# Altium schematic sheet Half_Bridges.SchDoc
size B; SheetNumber: 3; SheetTotal: 4
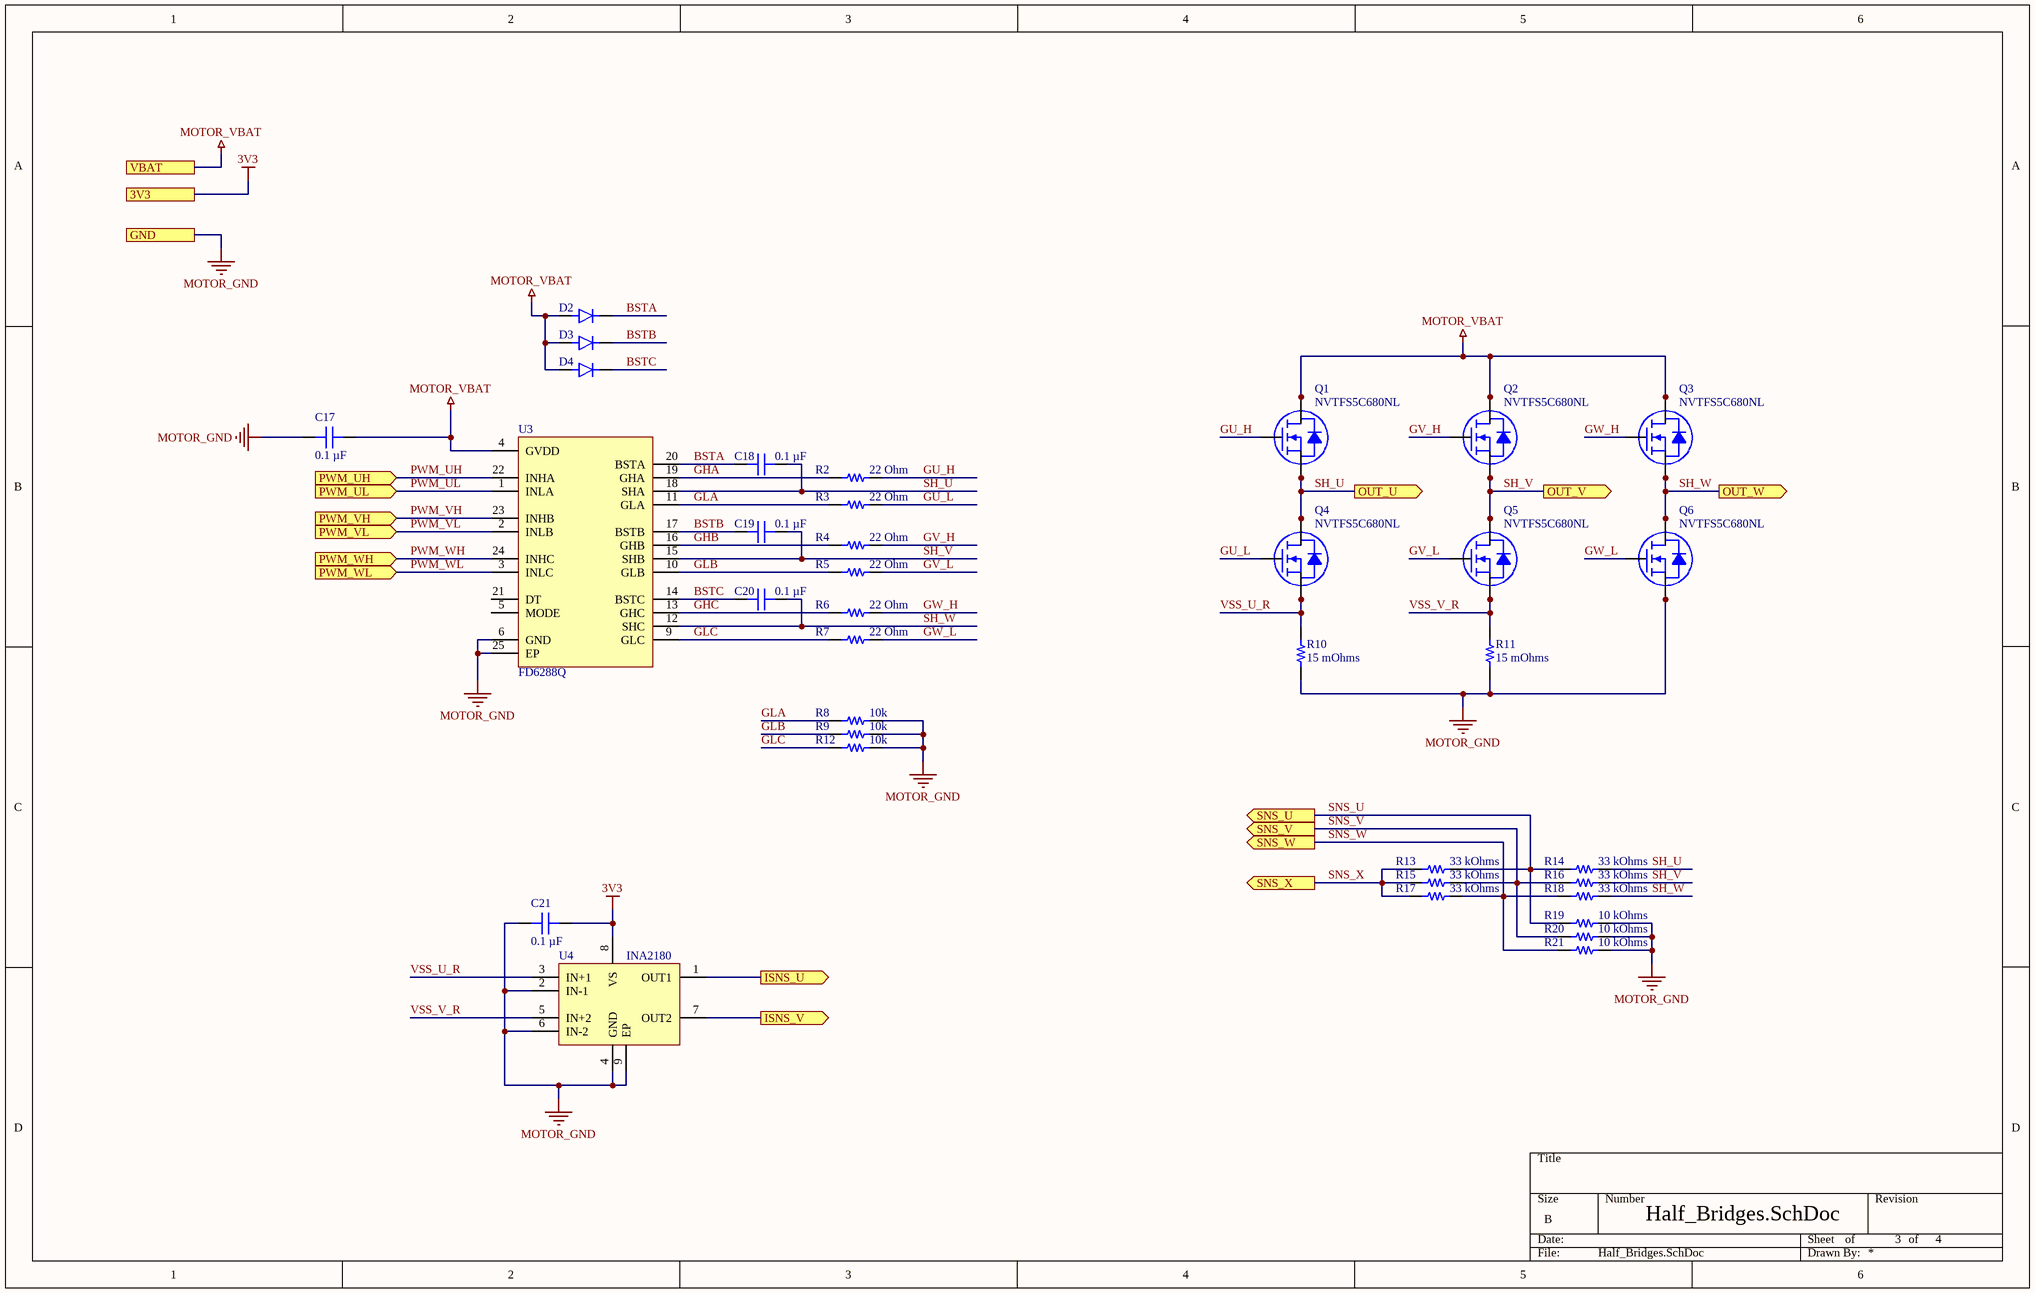
[diagram p0: Half_Bridges.SchDoc]

## Parts
C17  0.1 µF  [CAP 0402_1005]
C18  0.1 µF  [CAP 0402_1005]
C19  0.1 µF  [CAP 0402_1005]
C20  0.1 µF  [CAP 0402_1005]
C21  0.1 µF  [CAP 0402_1005]
D2  Diode  [Diode DFN1608D-2 (SOD1608)]  (value not drawn)
D3  Diode  [Diode DFN1608D-2 (SOD1608)]  (value not drawn)
D4  Diode  [Diode DFN1608D-2 (SOD1608)]  (value not drawn)
Q1  NVTFS5C680NL  [NVTFS015N04CTAG]
Q2  NVTFS5C680NL  [NVTFS015N04CTAG]
Q3  NVTFS5C680NL  [NVTFS015N04CTAG]
Q4  NVTFS5C680NL  [NVTFS015N04CTAG]
Q5  NVTFS5C680NL  [NVTFS015N04CTAG]
Q6  NVTFS5C680NL  [NVTFS015N04CTAG]
R2  22 Ohm  [RES 0402_1005]
R3  22 Ohm  [RES 0402_1005]
R4  22 Ohm  [RES 0402_1005]
R5  22 Ohm  [RES 0402_1005]
R6  22 Ohm  [RES 0402_1005]
R7  22 Ohm  [RES 0402_1005]
R8  10k  [RES 0402_1005]
R9  10k  [RES 0402_1005]
R10  15 mOhms  [RES 0805_2012]
R11  15 mOhms  [RES 0805_2012]
R12  10k  [RES 0402_1005]
R13  33 kOhms  [RES 0402_1005]
R14  33 kOhms  [RES 0402_1005]
R15  33 kOhms  [RES 0402_1005]
R16  33 kOhms  [RES 0402_1005]
R17  33 kOhms  [RES 0402_1005]
R18  33 kOhms  [RES 0402_1005]
R19  10 kOhms  [RES 0402_1005]
R20  10 kOhms  [RES 0402_1005]
R21  10 kOhms  [RES 0402_1005]
U3  FD6288Q  [QFN50P400X400X100-25N]
U4  INA2180  [WSON-8_2x2]

## Ports
3V3, GND, ISNS_U (out), ISNS_V (out), OUT_U (out), OUT_V (out), OUT_W (out), PWM_UH (in), PWM_UL (in), PWM_VH (in), PWM_VL (in), PWM_WH (in), PWM_WL (in), SNS_U (out), SNS_V (out), SNS_W (out), SNS_X (out), VBAT

## Nets
3V3: C21.1 U4.8(VS) ; port 3V3
MOTOR_GND: C17.1 C21.2 Q6.1(S) Q6.2(S) Q6.3(S) R8.2 R9.2 R10.1 R11.1 R12.2 R19.1 R20.1 R21.1 U3.6(GND) U3.25(EP) U4.2(IN-1) U4.4(GND) U4.6(IN-2) U4.9(EP) ; port GND
MOTOR_VBAT: C17.2 D2.2(BLUE(C)) D3.2(BLUE(C)) D4.2(BLUE(C)) Q1.5(D) Q1.6(D) Q1.7(D) Q1.8(D) Q2.5(D) Q2.6(D) Q2.7(D) Q2.8(D) Q3.5(D) Q3.6(D) Q3.7(D) Q3.8(D) U3.4(GVDD) ; port VBAT
BSTA: C18.1 D2.1(A) U3.20(BSTA)
BSTB: C19.1 D3.1(A) U3.17(BSTB)
BSTC: C20.1 D4.1(A) U3.14(BSTC)
GHA: R2.1 U3.19(GHA)
GHB: R4.1 U3.16(GHB)
GHC: R6.1 U3.13(GHC)
GLA: R3.1 R8.1 U3.11(GLA)
GLB: R5.1 R9.1 U3.10(GLB)
GLC: R7.1 R12.1 U3.9(GLC)
GU_H: Q1.4(G) R2.2
GU_L: Q4.4(G) R3.2
GV_H: Q2.4(G) R4.2
GV_L: Q5.4(G) R5.2
GW_H: Q3.4(G) R6.2
GW_L: Q6.4(G) R7.2
ISNS_U: U4.1(OUT1) ; port ISNS_U
ISNS_V: U4.7(OUT2) ; port ISNS_V
PWM_UH: U3.22(INHA) ; port PWM_UH
PWM_UL: U3.1(INLA) ; port PWM_UL
PWM_VH: U3.23(INHB) ; port PWM_VH
PWM_VL: U3.2(INLB) ; port PWM_VL
PWM_WH: U3.24(INHC) ; port PWM_WH
PWM_WL: U3.3(INLC) ; port PWM_WL
SH_U: C18.2 Q1.1(S) Q1.2(S) Q1.3(S) Q4.5(D) Q4.6(D) Q4.7(D) Q4.8(D) R14.2 U3.18(SHA) ; port OUT_U
SH_V: C19.2 Q2.1(S) Q2.2(S) Q2.3(S) Q5.5(D) Q5.6(D) Q5.7(D) Q5.8(D) R16.2 U3.15(SHB) ; port OUT_V
SH_W: C20.2 Q3.1(S) Q3.2(S) Q3.3(S) Q6.5(D) Q6.6(D) Q6.7(D) Q6.8(D) R18.2 U3.12(SHC) ; port OUT_W
SNS_U: R13.2 R14.1 R19.2 ; port SNS_U
SNS_V: R15.2 R16.1 R20.2 ; port SNS_V
SNS_W: R17.2 R18.1 R21.2 ; port SNS_W
SNS_X: R13.1 R15.1 R17.1 ; port SNS_X
VSS_U_R: Q4.1(S) Q4.2(S) Q4.3(S) R10.2 U4.3(IN+1)
VSS_V_R: Q5.1(S) Q5.2(S) Q5.3(S) R11.2 U4.5(IN+2)

Not connected (* = marked no-connect by the designer): U3 5(MODE) 21(DT)

## Notes on the sheet
- of

## Library data of the parts
C17-C21 = C0402C104K4RACAUTO: CAP CER 0.1UF 16V X7R 0402; manufacturer: KEMET; Tolerance: ±10%; Part Number: C0402C104K4RACAUTO; Value: 0.1 µF; Applications: Automotive, Bypass, Decoupling; Capacitance: 0.1 µF; componentlink1description: Datasheet; componentlink1url: https://api.kemet.com/component-edge/download/specsheet/C0402C104K4RACAUTO.pdf; componentlink2description: DigiKey Link; componentlink2url: https://www.digikey.com/en/products/detail/kemet/C0402C104K4RACAUTO/3314827; Device Package: 0402 (1005 Metric); lastupdated: 8/14/2022 9:05:51 PM; Lifecycle Status: Active; Minimum Order: 1; Mounting Type: Surface Mount, MLCC; Operating Temperature: -55°C ~ 125°C; Package / Case: 0402 (1005 Metric); packaging: TapeAndReel; partid: 3024; Part Status: Active; price: 0.01; Ratings: AEC-Q200; series: SMD Auto X7R; Size / Dimension: 0.039" L x 0.020" W (1.00mm x 0.50mm); Supplier 1: DigiKey; Supplier Part Number 1: 399-6828-1-ND; Temperature Coefficient: X7R; Thickness (Max): 0.022" (0.55mm); Voltage - Rated: 16V
D2-D4 = Diode: DFN1608D-2 (SOD1608); Manufacturer: Cree; ComponentLink2Description: Datasheet; Temperature: -40°C to +100°C; Package: LED_3MM2X2MM8; Supplier 2: Mouser; Price: 0.203999996142; Supplier 1: Digi-Key; ComponentLink1URL: https://upverter.com/upn/revision/9d0b31f7b1982705/; Supplier Part Number 2: 941-CLV1LFKBC7673673; Supplier Part Number 1: CLV1L-FKB-CHMMQEHBB7673673-ND; ComponentLink1Description: Upverter; ComponentLink2URL: http://www.cree.com/~/media/Files/Cree/LED-Components-and-Modules/HB/Data-Sheets/CLV1L-FKB-1238.pdf; RoHS: TRUE; Mouser Part Number: 941-CLV1LFKBC7673673; Temperature Range High: +100°C; Digikey Description: DIODE LED RGB DIFFUSED 4LCC SMD; Digikey Part Number: CLV1L-FKB-CHMMQEHBB7673673-ND; Lead Free: yes; Temperature Range Low: -40°C
Q1-Q6 = NVTFS5C680NL: N-FET
R2-R9 R12-R21 = RK73H1ETTP1432F: RES 14.3K OHM 1% 1/10W 0402; Manufacturer: KOA Speer Electronics, Inc.; Power (Watts): 0.1W, 1/10W; Resistance: 14.3 kOhms; Temperature Coefficient: ±100ppm/°C; Part Number: RK73H1ETTP1432F; ComponentLink1Description: Datasheet; ComponentLink1URL: http://www.koaspeer.com/catimages/Products/RK73H/RK73H.pdf; ComponentLink2Description: DigiKey Link; ComponentLink2URL: https://www.digikey.com/en/products/detail/koa-speer-electronics-inc/RK73H1ETTP1432F/9844351; Composition: Thick Film; Device Package: 0402 (1005 Metric); Features: Automotive AEC-Q200, Moisture Resistant; Height - Seated (Max): 0.016" (0.40mm); LastUpdated: 8/14/2022 9:23:49 PM; Lifecycle Status: Active; Minimum Order: 1; Number of Terminations: 2; Operating Temperature: -55°C ~ 155°C; Package / Case: 0402 (1005 Metric); Packaging: CutTape; PartId: 10193; Part Status: Active; Price: 0.01; Ratings: AEC-Q200; Series: RK73H; Size / Dimension: 0.039" L x 0.020" W (1.00mm x 0.50mm); Supplier 1: DigiKey; Supplier Part Number 1: 2019-RK73H1ETTP1432FCT-ND; Supplier Device Package: 0402; Tolerance: ±1%
  R2-R7: Value: 22 Ohm
  R8 R9 R12: Value: 10k
  R13-R18: Value: 33 kOhms
  R19-R21: Value: 10 kOhms
R10 R11 = PCAN0805E2002BST5: RES SMD 20K OHM 0.1% 1W 0805; Manufacturer: Vishay Thin Film; Resistance: 20 kOhms; Temperature Coefficient: ±25ppm/°C; Part Number: PCAN0805E2002BST5; Value: 15 mOhms; ComponentLink1Description: Datasheet; ComponentLink1URL: http://www.vishay.com/docs/60125/pcan.pdf; ComponentLink2Description: DigiKey Link; ComponentLink2URL: http://digikey.com/product-detail/en/vishay-thin-film/PCAN0805E2002BST5/764-1242-1-ND/6003316; Composition: Thin Film; Device Package: 0805 (2012 Metric); Features: Flame Proof, Moisture Resistant, Safety; Height - Seated (Max): 0.018" (0.46mm); LastUpdated: 8/26/2022 12:02:22 PM; Lifecycle Status: Active; Minimum Order: 1; Number of Terminations: 2; Operating Temperature: -55°C ~ 155°C; Package / Case: 0805 (2012 Metric); Packaging: TapeAndReel; PartId: 32096; Part Status: Active; Power (Watts): 1W; Price: 0.59; Series: PCAN; Size / Dimension: 0.080" L x 0.050" W (2.03mm x 1.27mm); Supplier 1: DigiKey; Supplier Part Number 1: 764-1242-1-ND; Supplier Device Package: 0805; Tolerance: ±0.1%
U3 = FD6288Q: 3 Phase Gate Driver 1.5-2.2A; MF: Texas Instruments; MP: UCC27282DRCR; Texas_Instruments-Purchase-URL: https://snapeda.com/shop?store=Texas+Instruments&id=3625400; Price: None; Availability: Warning; Package: VSON-10 Texas Instruments; SnapEDA_Link: https://www.snapeda.com/parts/UCC27282DRCR/Texas%20Instruments/view-part/3625400/?ref=snap; DigiKey-Purchase-URL: https://snapeda.com/shop?store=DigiKey&id=3625400; Value: *
U4 = INA2180: Current sense amplifier 4 channel